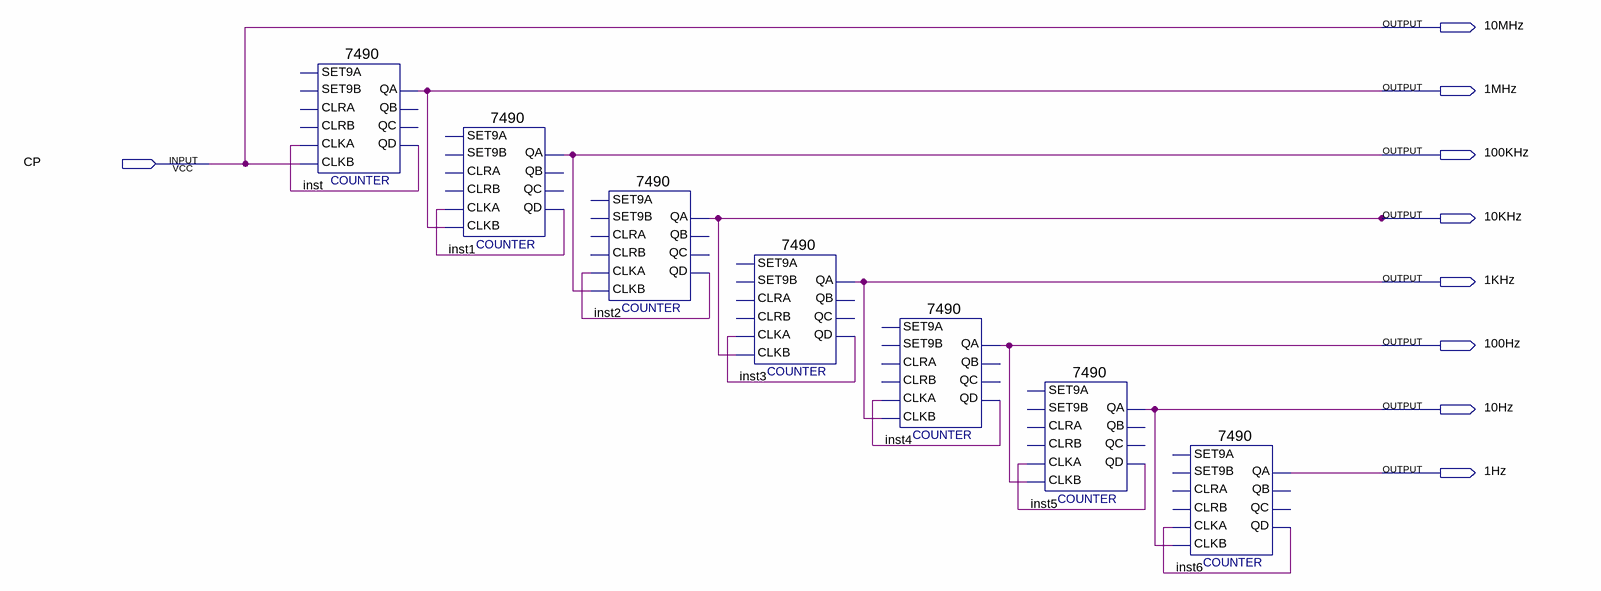
[diagram p0: schematic sheet]
// Quartus schematic choose.bdf as structural Verilog: 7 symbols, 9 pins
module choose (
  input  CP,
  output \10MHz ,
  output \1MHz ,
  output \100KHz ,
  output \10KHz ,
  output \1KHz ,
  output \100Hz ,
  output \10Hz ,
  output \1Hz 
);

  wire inst1_qd, inst2_qd, inst3_qd, inst4_qd, inst5_qd, inst6_qd, inst_qd;

  \7490  inst (.CLKB(CP), .CLKA(inst_qd), .QD(inst_qd), .QA(\1MHz ));  // open: SET9A, CLRA, SET9B, CLRB, QB, QC
  \7490  inst1 (
    .CLKB(\1MHz ), .CLKA(inst1_qd), .QD(inst1_qd), .QA(\100KHz ));  // open: SET9A, CLRA, SET9B, CLRB, QB, QC
  \7490  inst2 (
    .CLKB(\100KHz ), .CLKA(inst2_qd), .QD(inst2_qd), .QA(\10KHz ));  // open: SET9A, CLRA, SET9B, CLRB, QB, QC
  \7490  inst3 (.CLKB(\10KHz ), .CLKA(inst3_qd), .QD(inst3_qd), .QA(\1KHz ));  // open: SET9A, CLRA, SET9B, CLRB, QB, QC
  \7490  inst4 (.CLKB(\1KHz ), .CLKA(inst4_qd), .QD(inst4_qd), .QA(\100Hz ));  // open: SET9A, CLRA, SET9B, CLRB, QB, QC
  \7490  inst5 (.CLKB(\100Hz ), .CLKA(inst5_qd), .QD(inst5_qd), .QA(\10Hz ));  // open: SET9A, CLRA, SET9B, CLRB, QB, QC
  \7490  inst6 (.CLKB(\10Hz ), .CLKA(inst6_qd), .QD(inst6_qd), .QA(\1Hz ));  // open: SET9A, CLRA, SET9B, CLRB, QB, QC

  assign \10MHz  = CP;
endmodule
